# Altium schematic sheet PLD_MemoryInterface.SchDoc: ADC for SunSref,Photodiodes and HK
size A4; SheetTotal: 32
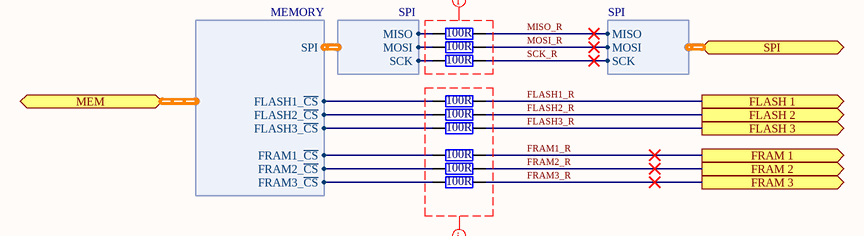
[diagram p0: PLD_MemoryInterface.SchDoc]

## Parts
MEM_R1  100R  [SMD_Resistor_0603]
MEM_R2  100R  [SMD_Resistor_0603]
MEM_R3  100R  [SMD_Resistor_0603]
MEM_R4  100R  [SMD_Resistor_0603]
MEM_R5  100R  [SMD_Resistor_0603]
MEM_R6  100R  [SMD_Resistor_0603]
MEM_R7  100R  [SMD_Resistor_0603]
MEM_R8  100R  [SMD_Resistor_0603]
MEM_R9  100R  [SMD_Resistor_0603]

## Ports
FLASH 1 (out), FLASH 2 (out), FLASH 3 (out), FRAM 1 (out), FRAM 2 (out), FRAM 3 (out), MEM (harness MEMORY), SPI (harness SPI)

## Harnesses
MEMORY: SPI, FLASH1_~{CS}, FRAM1_~{CS}, FLASH2_~{CS}, FLASH3_~{CS}, FRAM2_~{CS}, FRAM3_~{CS}
SPI: MISO, MOSI, SCK

## Nets
FLASH1_R: MEM_R4.2 ; port FLASH 1
FLASH2_R: MEM_R5.2 ; port FLASH 2
FLASH3_R: MEM_R6.2 ; port FLASH 3
FRAM1_R: MEM_R7.2 ; port FRAM 1
FRAM2_R: MEM_R8.2 ; port FRAM 2
FRAM3_R: MEM_R9.2 ; port FRAM 3
MISO_R: MEM_R1.2 ; port SPI.MISO
MOSI_R: MEM_R2.2 ; port SPI.MOSI
SCK_R: MEM_R3.2 ; port SPI.SCK
NetMEM_R1_1: MEM_R1.1 ; harness SPI.MISO
NetMEM_R2_1: MEM_R2.1 ; harness SPI.MOSI
NetMEM_R3_1: MEM_R3.1 ; harness SPI.SCK
NetMEM_R4_1: MEM_R4.1 ; port MEM.FLASH1_~{CS}
NetMEM_R5_1: MEM_R5.1 ; port MEM.FLASH2_~{CS}
NetMEM_R6_1: MEM_R6.1 ; port MEM.FLASH3_~{CS}
NetMEM_R7_1: MEM_R7.1 ; port MEM.FRAM1_~{CS}
NetMEM_R8_1: MEM_R8.1 ; port MEM.FRAM2_~{CS}
NetMEM_R9_1: MEM_R9.1 ; port MEM.FRAM3_~{CS}

## Layout directives
net class SPI: (no net found under the mark)
net class SPI_CS: (no net found under the mark)

## Notes on the sheet
- Title:
- Project:
- Author:
- Model:
- Document Number:
- Checked by:
- Rev:
- Date:
- Approved by:
- Sheet:
- of
- File name:

## Library data of the parts
MEM_R1-MEM_R9 = Res: Value: 100R; Package: 0603